# Altium schematic sheet Sheet_1_2022-01-22.schdoc
size 49 x 37 mm
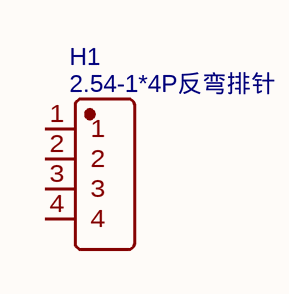
[diagram p0: Sheet_1_2022-01-22.schdoc]

## Parts
H1  2.54-1*4P反弯排针  [HDR-TH_4P-P2.54-H-M-W10.4]

## Nets

Not connected (* = marked no-connect by the designer): H1 1 2 3 4

## Library data of the parts
H1 = 2.54-1*4P反弯排针: BOM_Manufacturer: BOOMELE(博穆精密); Contributor: LCSC; BOM_Supplier: LCSC; BOM_Supplier Part: C91552; BOM_Manufacturer Part: 2.54-1*4P反弯排针; BOM_JLCPCB Part Class: Extended Part; spicePre: H; spiceSymbolName: 2.54-1*4P反弯排针